# Altium schematic sheet USB-FTDI.SchDoc
size A
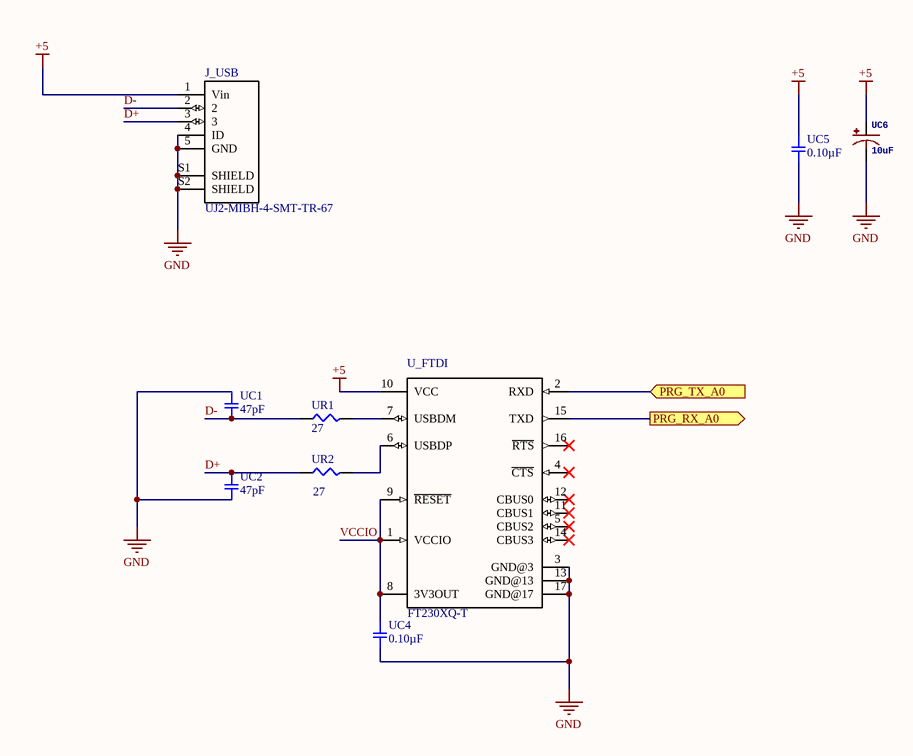
[diagram p0: USB-FTDI.SchDoc]

## Parts
J_USB  UJ2-MIBH-4-SMT-TR-67  [*CUI_UJ2-MIBH-4-SMT-TR-67_UJ2-MIBH-4-SMT-TR-67(Primary)]
U_FTDI  FT230XQ-T  [*QFN16]
UC1  47pF  [SMD-0603C]
UC2  47pF  [SMD-0603C]
UC4  0.10µF  [SMD-0603C]
UC5  0.10µF  [SMD-0603C]
UC6  10uF  [0603-POLAR]
UR1  27  [SMD-0603-RES]
UR2  27  [SMD-0603-RES]

## Ports
PRG_RX_A0 (out), PRG_TX_A0 (in)

## Nets
+5: J_USB.1(Vin) U_FTDI.10(VCC) UC5.1 UC6.+
GND: J_USB.4(ID) J_USB.5(GND) J_USB.S1(SHIELD) J_USB.S2(SHIELD) U_FTDI.3(GND@3) U_FTDI.13(GND@13) U_FTDI.17(GND@17) UC1.1 UC2.2 UC4.2 UC5.2 UC6.-
D+: J_USB.3 UC2.1 UR2.1
D-: J_USB.2 UC1.2 UR1.1
PRG_RX_A0: U_FTDI.15(TXD) ; port PRG_RX_A0
PRG_TX_A0: U_FTDI.2(RXD) ; port PRG_TX_A0
VCCIO: U_FTDI.1(VCCIO) U_FTDI.8(3V3OUT) U_FTDI.9(~{RESET}) UC4.1
NetU_FTDI_6: U_FTDI.6(USBDP) UR2.2
NetU_FTDI_7: U_FTDI.7(USBDM) UR1.2

Not connected (* = marked no-connect by the designer): U_FTDI 4(~{CTS})* 5(CBUS2)* 11(CBUS1)* 12(CBUS0)* 14(CBUS3)* 16(~{RTS})*

## Library data of the parts
J_USB = UJ2-MIBH-4-SMT-TR-67: Micro B, USB 2.0, 1.8 A, Right Angle, Surface Mount _SMT_, Waterproof, USB Receptacle; MF: CUI Devices; Digi-Key_Purchase_URL: https://www.digikey.com/product-detail/en/cui-devices/UJ2-MIBH-4-SMT-TR-67/102-4970-1-ND/9564435?utm_source=snapeda&utm_medium=aggregator&utm_campaign=symbol; CUI_purchase_URL: https://www.cuidevices.com/product/interconnect/connectors/usb-connectors/uj2-mibh-4-smt-tr-67?utm_source=snapeda.com&utm_medium=referral&utm_campaign=snapedaBOM; Package: None; MP: UJ2-MIBH-4-SMT-TR-67; SnapEDA_Link: https://www.snapeda.com/parts/UJ2-MIBH-4-SMT-TR-67/CUI%20Devices/view-part/?ref=snap; Digi-Key_Part_Number: 102-4970-1-ND; Value: *
U_FTDI = FT230XQ-T: USB Full Speed to Basic UART IC with USB Charger Detection, QFN-16; MF: FTDI,; MP: FT230XQ-T; Digi-Key_Purchase_URL: https://www.digikey.com/product-detail/en/ftdi-future-technology-devices-international-ltd/FT230XQ-T/768-1153-ND/3749474?utm_source=snapeda&utm_medium=aggregator&utm_campaign=symbol; Package: QFN-16 FTDI; SnapEDA_Link: https://www.snapeda.com/parts/FT230XQ-T/FTDI%2C%20Future%20Technology%20Devices%20International%20Ltd/view-part/?ref=snap; Digi-Key_Part_Number: 768-1153-ND; Value: *
UC1 UC2 = GCM1885C2A470JA16D: CAP CER 47PF 100V NP0 0603; Manufacturer: Murata Electronics North America; Factory Stock: 0; Unit Price (USD): 0.1; Minimum Quantity: 1; Tolerance: ±5%; Temperature Coefficient: C0G, NP0; Datasheets: http://www.murata.com/~/media/webrenewal/support/library/catalog/products/capacitor/mlcc/c03e.ashx; Image: //media.digikey.com/Renders/Murata%20Renders/0603%28GCM188%29.jpg; Digi-Key Part Number: 490-4944-1-ND; Part Number: GCM1885C2A470JA16D; Quantity Available: 586; @ qty: 0; Packaging: Cut Tape (CT); Series: GCM; Part Status: Active; Value: 47pF; Voltage: 100V; Operating Temperature: -55°C ~ 125°C; Features: -; Ratings: AEC-Q200; Applications: Automotive; Mounting Type: Surface Mount, MLCC; Package / Case: 0603 (1608 Metric); Size / Dimension: 0.063" L x 0.031" W (1.60mm x 0.80mm); Height - Seated (Max): -; Thickness (Max): 0.035" (0.90mm); Lead Spacing: -; Lead Style: -
UC4 UC5 = GCM188R71C104KA37D: CAP CER 0.1UF 16V X7R 0603; Manufacturer: Murata Electronics North America; Factory Stock: 0; Unit Price (USD): 0.18; Minimum Quantity: 1; Tolerance: ±10%; Datasheets: http://www.murata.com/~/media/webrenewal/support/library/catalog/products/capacitor/mlcc/c03e.ashx; Image: //media.digikey.com/Renders/Murata%20Renders/0603%28GCM188%29.jpg; Digi-Key Part Number: 490-4774-1-ND; Part Number: GCM188R71C104KA37D; Quantity Available: 284085; @ qty: 0; Packaging: Cut Tape (CT); Series: GCM; Part Status: Active; Value: 0.10µF; Voltage: 16V; Temperature Coefficient: X7R; Operating Temperature: -55°C ~ 125°C; Features: -; Ratings: AEC-Q200; Applications: Automotive; Mounting Type: Surface Mount, MLCC; Package / Case: 0603 (1608 Metric); Size / Dimension: 0.063" L x 0.031" W (1.60mm x 0.80mm); Height - Seated (Max): -; Thickness (Max): 0.035" (0.90mm); Lead Spacing: -; Lead Style: -
UC6 = 10UF-POLAR-0603-6.3V-20%(TANT): GateName_1: G$1; SymbolName_1: CAP_POL; PROD_ID: CAP-13210; DeviceName: -0603-6.3V-20%(TANT); LibraryName: SparkFun-Capacitors; DeviceSetName: 10UF-POLAR; Package: 0603-POLAR
UR1 UR2 = ERJ-3EKF27R0V: RES SMD 27 OHM 1% 1/10W 0603; Manufacturer: Panasonic Electronic Components; Factory Stock: 0; Unit Price (USD): 0.00379; @ qty: 1500; Minimum Quantity: 1; Power (Watts): 0.1W, 1/10W; Temperature Coefficient: ±100ppm/°C; Part Number: ERJ-3EKF27R0V; Datasheets: http://industrial.panasonic.com/www-cgi/jvcr13pz.cgi?E+PZ+3+AOA0002+ERJ3EKF27R0V+7+WW; Image: //media.digikey.com/Photos/Panasonic%20Photos/MFG_ERJ-P6W%20Series.jpg; Digi-Key Part Number: P27.0HCT-ND; Quantity Available: 283006; Packaging: Cut Tape (CT); Series: ERJ; Part Status: Active; Value: 27; Tolerance: ±1%; Composition: Thick Film; Features: Automotive AEC-Q200; Operating Temperature: -55°C ~ 155°C; Package / Case: 0603 (1608 Metric); Supplier Device Package: 0603; Size / Dimension: 0.063" L x 0.031" W (1.60mm x 0.80mm); Height - Seated (Max): 0.022" (0.55mm); Number of Terminations: 2; Failure Rate: -